# EAGLE design nhd-4_3-adapter (EAGLE 6.4)

## Sheet 1 of 2: TFT Conn
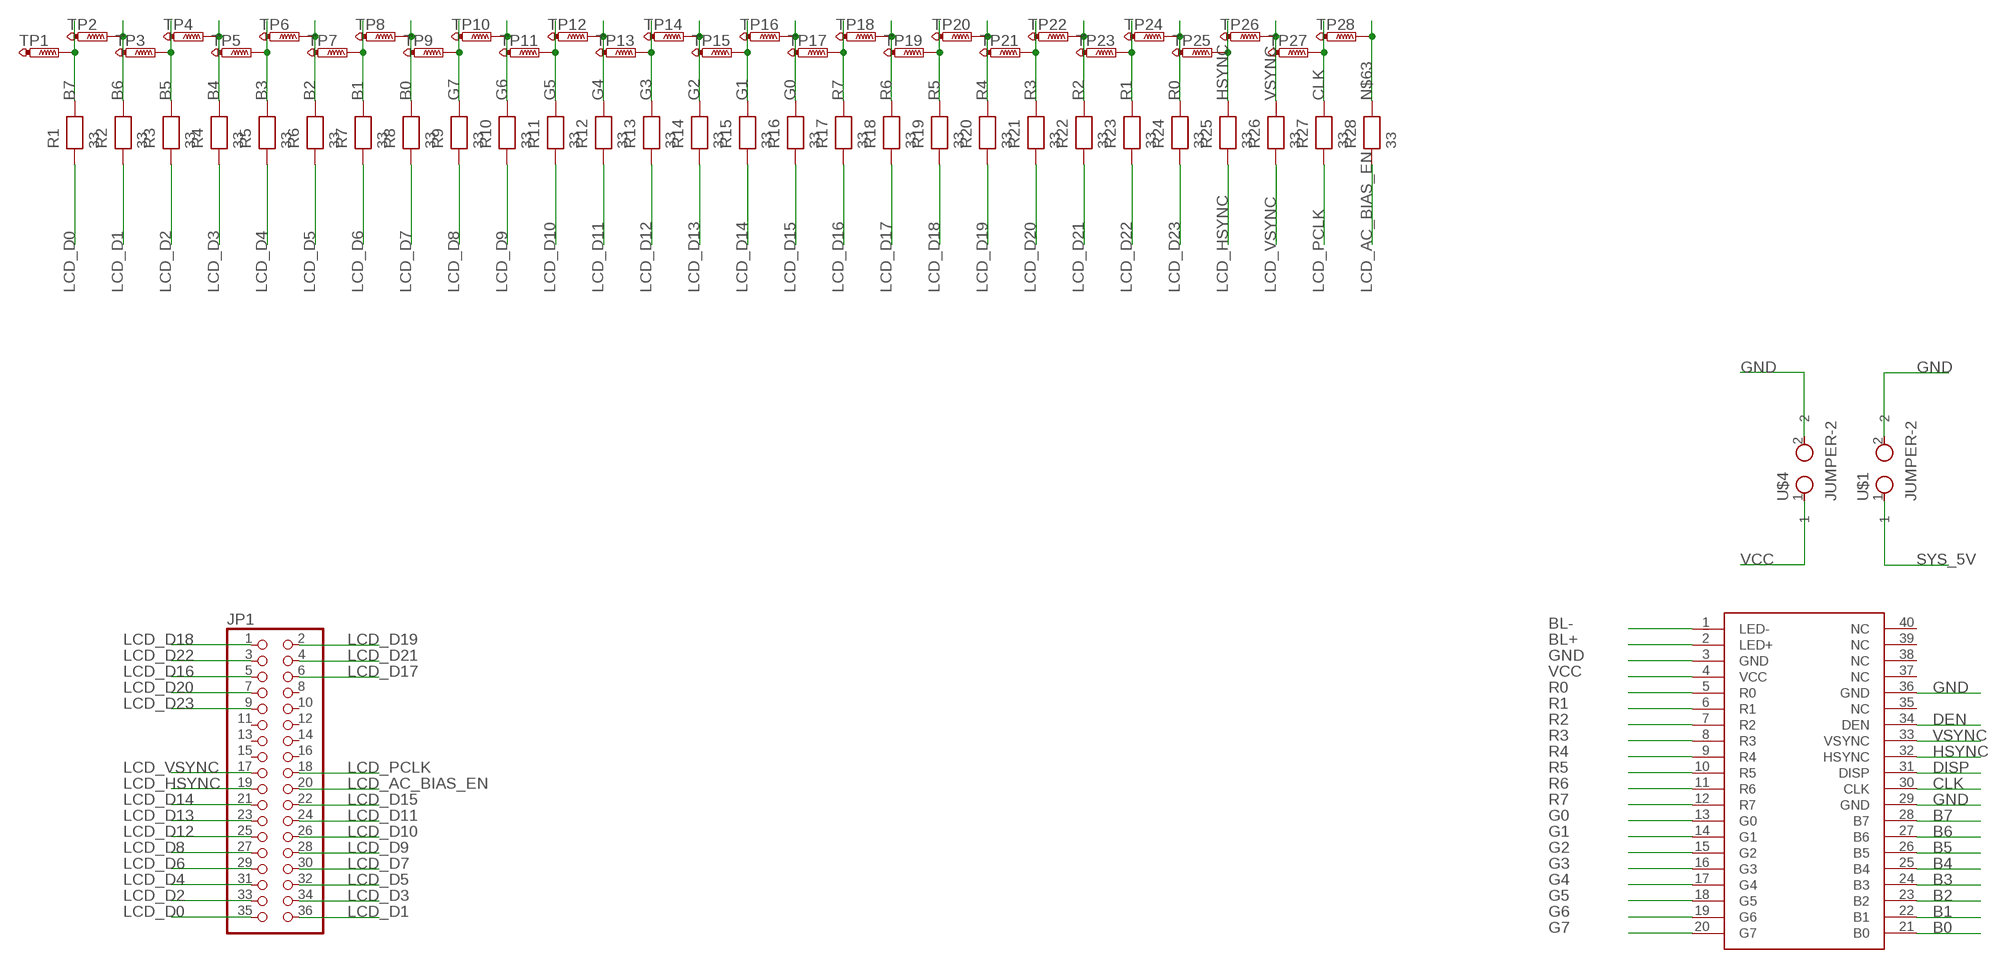
[diagram p0: schematic, sheet 1]

### Parts
JP1  PINHD-2X18_2.54  [2X18]
R1  33  PRES0402LEVEL3  [R0402]
R2  33  PRES0402LEVEL3  [R0402]
R3  33  PRES0402LEVEL3  [R0402]
R4  33  PRES0402LEVEL3  [R0402]
R5  33  PRES0402LEVEL3  [R0402]
R6  33  PRES0402LEVEL3  [R0402]
R7  33  PRES0402LEVEL3  [R0402]
R8  33  PRES0402LEVEL3  [R0402]
R9  33  PRES0402LEVEL3  [R0402]
R10  33  PRES0402LEVEL3  [R0402]
R11  33  PRES0402LEVEL3  [R0402]
R12  33  PRES0402LEVEL3  [R0402]
R13  33  PRES0402LEVEL3  [R0402]
R14  33  PRES0402LEVEL3  [R0402]
R15  33  PRES0402LEVEL3  [R0402]
R16  33  PRES0402LEVEL3  [R0402]
R17  33  PRES0402LEVEL3  [R0402]
R18  33  PRES0402LEVEL3  [R0402]
R19  33  PRES0402LEVEL3  [R0402]
R20  33  PRES0402LEVEL3  [R0402]
R21  33  PRES0402LEVEL3  [R0402]
R22  33  PRES0402LEVEL3  [R0402]
R23  33  PRES0402LEVEL3  [R0402]
R24  33  PRES0402LEVEL3  [R0402]
R25  33  PRES0402LEVEL3  [R0402]
R26  33  PRES0402LEVEL3  [R0402]
R27  33  PRES0402LEVEL3  [R0402]
R28  33  PRES0402LEVEL3  [R0402]
TFT1  NHD-4.3-480272EF-ATXL  [40-PIN_SMD]
TP1  TESTPAD_PTR1TP06R  [TESTPAD_TP06R]
TP2  TESTPAD_PTR1TP06R  [TESTPAD_TP06R]
TP3  TESTPAD_PTR1TP06R  [TESTPAD_TP06R]
TP4  TESTPAD_PTR1TP06R  [TESTPAD_TP06R]
TP5  TESTPAD_PTR1TP06R  [TESTPAD_TP06R]
TP6  TESTPAD_PTR1TP06R  [TESTPAD_TP06R]
TP7  TESTPAD_PTR1TP06R  [TESTPAD_TP06R]
TP8  TESTPAD_PTR1TP06R  [TESTPAD_TP06R]
TP9  TESTPAD_PTR1TP06R  [TESTPAD_TP06R]
TP10  TESTPAD_PTR1TP06R  [TESTPAD_TP06R]
TP11  TESTPAD_PTR1TP06R  [TESTPAD_TP06R]
TP12  TESTPAD_PTR1TP06R  [TESTPAD_TP06R]
TP13  TESTPAD_PTR1TP06R  [TESTPAD_TP06R]
TP14  TESTPAD_PTR1TP06R  [TESTPAD_TP06R]
TP15  TESTPAD_PTR1TP06R  [TESTPAD_TP06R]
TP16  TESTPAD_PTR1TP06R  [TESTPAD_TP06R]
TP17  TESTPAD_PTR1TP06R  [TESTPAD_TP06R]
TP18  TESTPAD_PTR1TP06R  [TESTPAD_TP06R]
TP19  TESTPAD_PTR1TP06R  [TESTPAD_TP06R]
TP20  TESTPAD_PTR1TP06R  [TESTPAD_TP06R]
TP21  TESTPAD_PTR1TP06R  [TESTPAD_TP06R]
TP22  TESTPAD_PTR1TP06R  [TESTPAD_TP06R]
TP23  TESTPAD_PTR1TP06R  [TESTPAD_TP06R]
TP24  TESTPAD_PTR1TP06R  [TESTPAD_TP06R]
TP25  TESTPAD_PTR1TP06R  [TESTPAD_TP06R]
TP26  TESTPAD_PTR1TP06R  [TESTPAD_TP06R]
TP27  TESTPAD_PTR1TP06R  [TESTPAD_TP06R]
TP28  TESTPAD_PTR1TP06R  [TESTPAD_TP06R]
U$1  JUMPER-2  [1X02]
U$4  JUMPER-2  [1X02]

### Nets
B0: R8.P$2 TFT1.21(B0) TP8.TP
B1: R7.P$2 TFT1.22(B1) TP7.TP
B2: R6.P$2 TFT1.23(B2) TP6.TP
B3: R5.P$2 TFT1.24(B3) TP5.TP
B4: R4.P$2 TFT1.25(B4) TP4.TP
B5: R3.P$2 TFT1.26(B5) TP3.TP
B6: R2.P$2 TFT1.27(B6) TP2.TP
B7: R1.P$2 TFT1.28(B7) TP1.TP
BL+: TFT1.2(LED+) ; also sheet 2
BL-: TFT1.1(LED-) ; also sheet 2
CLK: R27.P$2 TFT1.30(CLK) TP27.TP
DEN: TFT1.34(DEN)
DISP: TFT1.31(DISP)
G0: R16.P$2 TFT1.13(G0) TP16.TP
G1: R15.P$2 TFT1.14(G1) TP15.TP
G2: R14.P$2 TFT1.15(G2) TP14.TP
G3: R13.P$2 TFT1.16(G3) TP13.TP
G4: R12.P$2 TFT1.17(G4) TP12.TP
G5: R11.P$2 TFT1.18(G5) TP11.TP
G6: R10.P$2 TFT1.19(G6) TP10.TP
G7: R9.P$2 TFT1.20(G7) TP9.TP
GND: TFT1.3(GND) TFT1.29(GND) TFT1.36(GND) U$1.2 U$4.2 ; also sheet 2
HSYNC: R25.P$2 TFT1.32(HSYNC) TP25.TP
LCD_AC_BIAS_EN: JP1.20 R28.P$1
LCD_D0: JP1.35 R1.P$1
LCD_D1: JP1.36 R2.P$1
LCD_D2: JP1.33 R3.P$1
LCD_D3: JP1.34 R4.P$1
LCD_D4: JP1.31 R5.P$1
LCD_D5: JP1.32 R6.P$1
LCD_D6: JP1.29 R7.P$1
LCD_D7: JP1.30 R8.P$1
LCD_D8: JP1.27 R9.P$1
LCD_D9: JP1.28 R10.P$1
LCD_D10: JP1.26 R11.P$1
LCD_D11: JP1.24 R12.P$1
LCD_D12: JP1.25 R13.P$1
LCD_D13: JP1.23 R14.P$1
LCD_D14: JP1.21 R15.P$1
LCD_D15: JP1.22 R16.P$1
LCD_D16: JP1.5 R17.P$1
LCD_D17: JP1.6 R18.P$1
LCD_D18: JP1.1 R19.P$1
LCD_D19: JP1.2 R20.P$1
LCD_D20: JP1.7 R21.P$1
LCD_D21: JP1.4 R22.P$1
LCD_D22: JP1.3 R23.P$1
LCD_D23: JP1.9 R24.P$1
LCD_HSYNC: JP1.19 R25.P$1
LCD_PCLK: JP1.18 R27.P$1
LCD_VSYNC: JP1.17 R26.P$1
N$63: R28.P$2 TP28.TP
R0: R24.P$2 TFT1.5(R0) TP24.TP
R1: R23.P$2 TFT1.6(R1) TP23.TP
R2: R22.P$2 TFT1.7(R2) TP22.TP
R3: R21.P$2 TFT1.8(R3) TP21.TP
R4: R20.P$2 TFT1.9(R4) TP20.TP
R5: R19.P$2 TFT1.10(R5) TP19.TP
R6: R18.P$2 TFT1.11(R6) TP18.TP
R7: R17.P$2 TFT1.12(R7) TP17.TP
SYS_5V: U$1.1 ; also sheet 2
VCC: TFT1.4(VCC) U$4.1 ; also sheet 2
VSYNC: R26.P$2 TFT1.33(VSYNC) TP26.TP
Unconnected: JP1.8 JP1.10 JP1.11 JP1.12 JP1.13 JP1.14 JP1.15 JP1.16 TFT1.35(NC) TFT1.37(NC) TFT1.38(NC) TFT1.39(NC) TFT1.40(NC)

## Sheet 2 of 2: Backlight
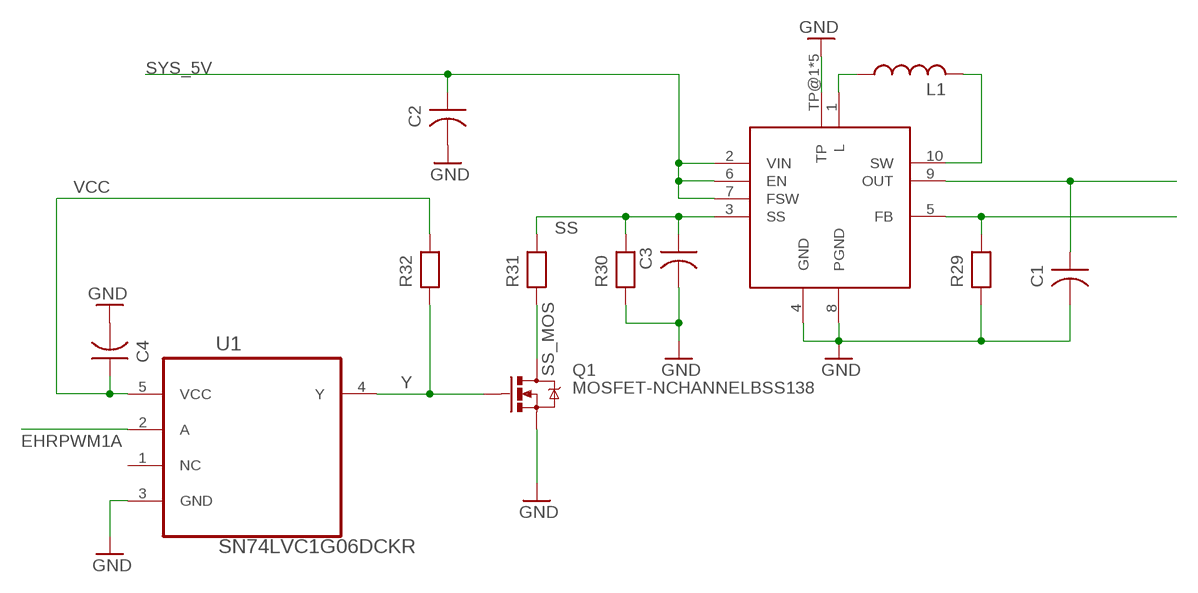
[diagram p1: schematic, sheet 2]

### Parts
C1  PCAP0805LEVEL3  [R0805]
C2  PCAP0805LEVEL3  [R0805]
C3  PCAP0603LEVEL3  [R0603]
C4  PCAP0603LEVEL3  [R0603]
L1  L-US  [VLCF4018-2]
Q1  MOSFET-NCHANNELBSS138  [SOT23]
R29  PRES0603LEVEL3  [R0603]
R30  PRES0603LEVEL3  [R0603]
R31  PRES0603LEVEL3  [R0603]
R32  PRES0603LEVEL3  [R0603]
U1  SN74LVC1G06DCKR  [SOT65P210X110-5N]
U$2  TPS61080  [VSON-10]

### Nets
BL+: C1.P$2 U$2.9(OUT) ; also sheet 1
BL-: R29.P$2 U$2.5(FB) ; also sheet 1
EHRPWM1A: U1.2(A)
GND: C1.P$1 C2.P$1 C3.P$1 C4.P$1 Q1.2(S) R29.P$1 R30.P$1 U1.3(GND) U$2.4(GND) U$2.8(PGND) U$2.TP@1(TP) U$2.TP@2(TP) U$2.TP@3(TP) U$2.TP@4(TP) U$2.TP@5(TP) ; also sheet 1
L: L1.1 U$2.1(L)
SS: C3.P$2 R30.P$2 R31.P$2 U$2.3(SS)
SS_MOS: Q1.3(D) R31.P$1
SW: L1.2 U$2.10(SW)
SYS_5V: C2.P$2 U$2.2(VIN) U$2.6(EN) U$2.7(FSW) ; also sheet 1
VCC: C4.P$2 R32.P$2 U1.5(VCC) ; also sheet 1
Y: Q1.1(G) R32.P$1 U1.4(Y)
Unconnected: U1.1(NC)

## Library data of the parts
C1 C2 = rcl_pro:PCAP0805
C3 C4 = rcl_pro:PCAP0603
JP1 = pinhead-1:PINHD-2X18: PIN HEADER
L1 = rcl:L-US: INDUCTOR, American symbol
Q1 = SparkFun-DiscreteSemi:MOSFET-NCHANNEL: Common NMOSFET Parts MFG P/N Store ID Prod ID FDD8780 TRANS-09984 SI7820DN TRANS-11055 FDS6630A IC-08089 2N7002PW TRANS-11151 FQP30N06L COM-10213 TRANS-10060 BSS123LT1G TRANS-08345 BSS138 TRANS-00830 BS170 2N7000; PROD_ID: TRANS-00830
R1-R28 = rcl_pro:PRES0402
R29-R32 = rcl_pro:PRES0603
TFT1 = molex_connectors_smd:NHD-4.3-480272EF-ATXL
TP1-TP28 = ALFAT_Lib:TESTPAD_PTR1: TEST PIN
U1 = Texas Instruments_By_element14_Batch_1:SN74LVC1G06DCKR: SINGLE INVERTER BUFFER/DRIVER WITH OPEN-DRAIN OUTPUT; MPN: SN74LVC1G06DCKR; OC_FARNELL: 1871697; OC_NEWARK: 76C4074; PACKAGE: SC70-5; SUPPLIER: Texas Instruments
U$1 U$4 = pinhead:JUMPER-2
U$2 = ti_backlight_driver:TPS61080: LED Controller - INPUT: 2.5V - 6V - OUTPUT: Up to 27V - TYPICAL OUTPUT - INPUT: 5V - 12V @ 400mA - 24V @ 170mA - Short Circuit Protection - 1.2-MHz / 600-kHz Selectable Fixed Switching Frequency - In/Out Isolation - Boost Conversion - 3V - 12V - 5V - 12V - 24V

## Board
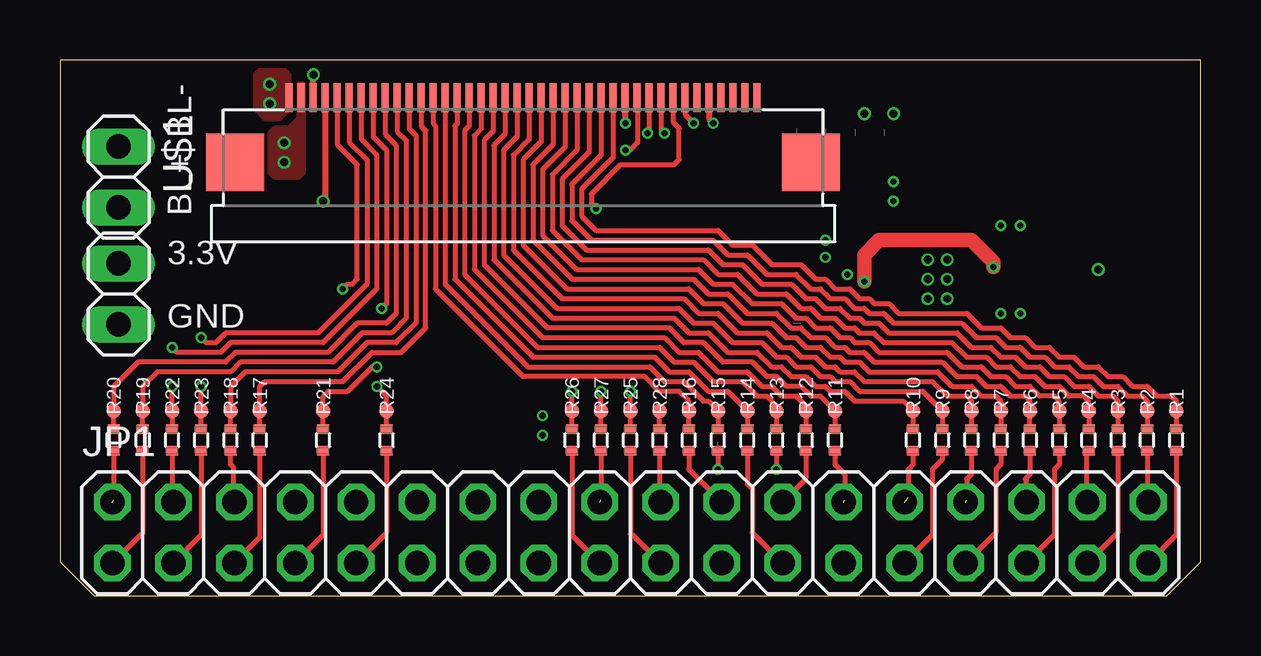
[diagram p2: board, top side]
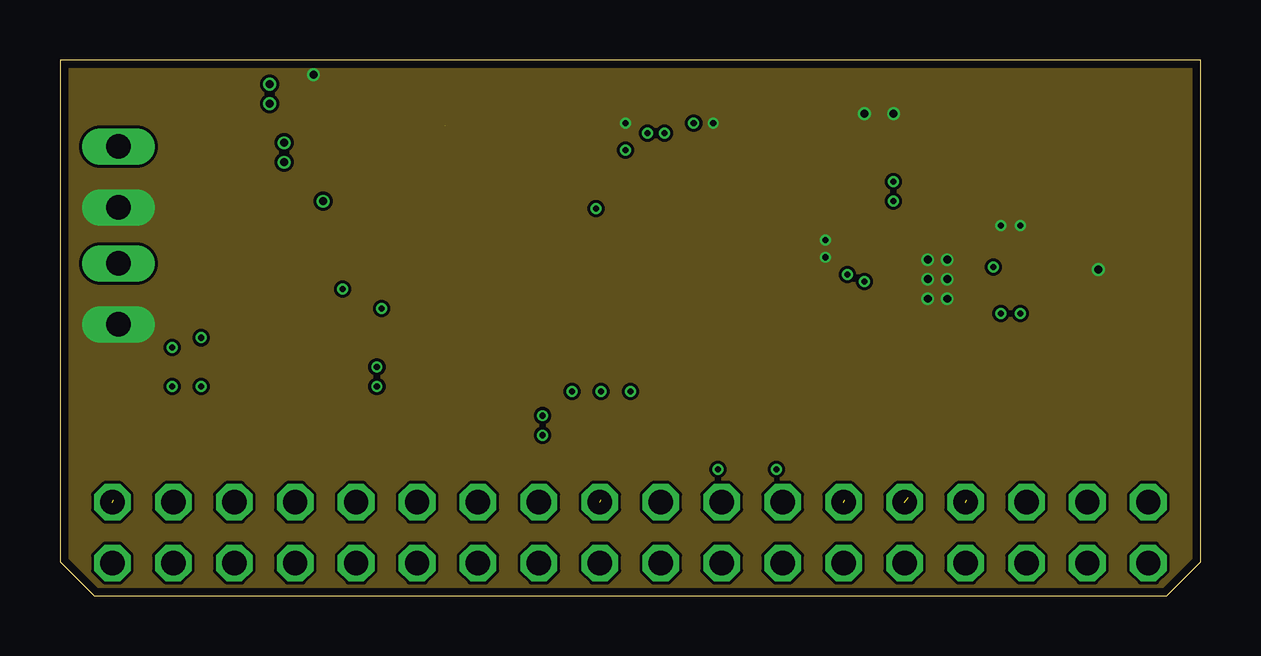
[diagram p3: board, inner layer Route2]
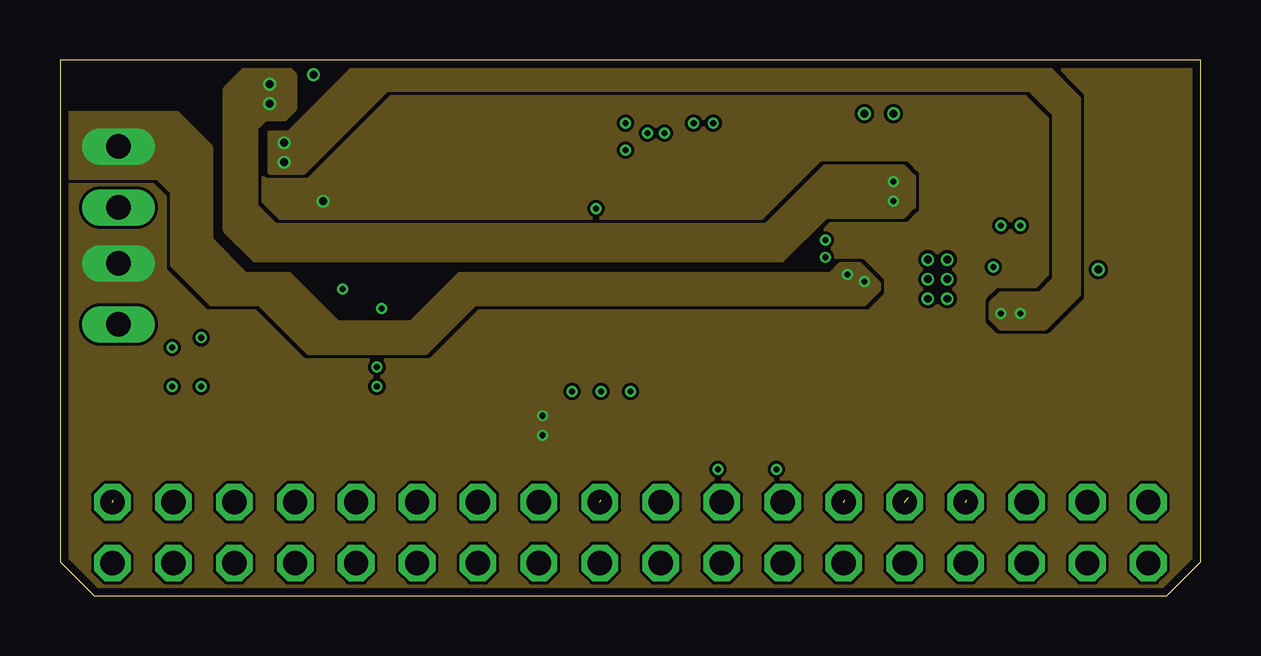
[diagram p4: board, inner layer Route3]
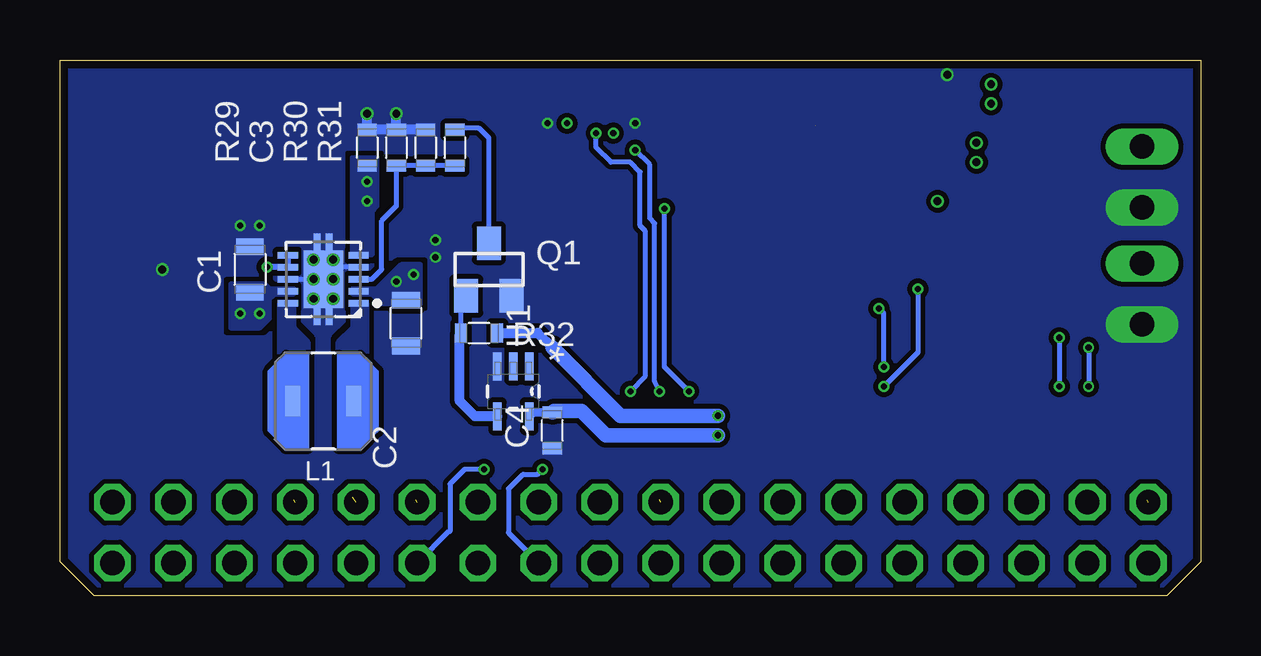
[diagram p5: board, bottom side, seen from below]

Size 47.55 x 22.35 mm. Coordinates in mm from the lower left corner, seen from the top.
Outline: 1.42,0 46.13,0 47.55,1.42 47.55,22.35 0,22.35 0,1.42 1.42,0
Copper layers (1*2*3*16): Top 0.035559375mm / dielectric 0.17018125mm / Route2 0.01778125mm / dielectric 47mil / Route3 0.01778125mm / dielectric 0.17018125mm / Bottom 0.035559375mm
Design rules "default *": minimum track width 5mil, minimum drill 10mil, track to track 5mil, track to pad 5mil, pad to pad 5mil, via to via 5mil, smd to smd 2mil, copper to edge 13mil, drill to drill 8mil, minimum pad ring 4mil, minimum via ring 4mil, stop-mask expansion 4mil, vias tented up to drill 13mil, thermal gap 10mil

### Footprints (pad centres in the part's own frame; a part is rotated, then mirrored left to right if it is on the bottom)
R0805 = smd 0.7 x 1.15: P$1 -0.95,0; P$2 0.95,0
R0603 = smd 0.5 x 0.8: P$1 -0.75,0; P$2 0.75,0
2X18 = drill 1.016 octagon: 1 -21.59,-1.27; 2 -21.59,1.27; 3 -19.05,-1.27; 4 -19.05,1.27; 5 -16.51,-1.27; 6 -16.51,1.27; 7 -13.97,-1.27; 8 -13.97,1.27; 9 -11.43,-1.27; 10 -11.43,1.27; 11 -8.89,-1.27; 12 -8.89,1.27; 13 -6.35,-1.27; 14 -6.35,1.27; 15 -3.81,-1.27; 16 -3.81,1.27; 17 -1.27,-1.27; 18 -1.27,1.27; 19 1.27,-1.27; 20 1.27,1.27; 21 3.81,-1.27; 22 3.81,1.27; 23 6.35,-1.27; 24 6.35,1.27; 25 8.89,-1.27; 26 8.89,1.27; 27 11.43,-1.27; 28 11.43,1.27; 29 13.97,-1.27; 30 13.97,1.27; 31 16.51,-1.27; 32 16.51,1.27; 33 19.05,-1.27; 34 19.05,1.27; 35 21.59,-1.27; 36 21.59,1.27
VLCF4018-2 = smd 1.27 x 0.635: 1 0,1.27; 2 0,-1.27
SOT23 = smd 1 x 1.4: 1 -0.95,-1.1; 2 0.95,-1.1; 3 0,1.1
R0402 = smd 0.4 x 0.5: P$1 -0.45,0; P$2 0.45,0
40-PIN_SMD = smd 0.3 x 1.2: 1 -9.75,0; 2 -9.25,0; 3 -8.75,0; 4 -8.25,0; 5 -7.75,0; 6 -7.25,0; 7 -6.75,0; 8 -6.25,0; 9 -5.75,0; 10 -5.25,0; 11 -4.75,0; 12 -4.25,0; 13 -3.75,0; 14 -3.25,0; 15 -2.75,0; 16 -2.25,0; 17 -1.75,0; 18 -1.25,0; 19 -0.75,0; 20 -0.25,0; 21 0.25,0; 22 0.75,0; 23 1.25,0; 24 1.75,0; 25 2.25,0; 26 2.75,0; 27 3.25,0; 28 3.75,0; 29 4.25,0; 30 4.75,0; 31 5.25,0; 32 5.75,0; 33 6.25,0; 34 6.75,0; 35 7.25,0; 36 7.75,0; 37 8.25,0; 38 8.75,0; 39 9.25,0; 40 9.75,0 | smd 2.4 x 2.4: P$41 -12,-2.7; P$42 12,-2.7
TESTPAD_TP06R = smd 0.6 x 0.6: TP 0,0
SOT65P210X110-5N = smd 1.168 x 0.356: 1 -1.041,0.66; 2 -1.041,0; 3 -1.041,-0.66; 4 1.041,-0.66; 5 1.041,0.66
1X02 = drill 1.016 long: 1 -1.27,0; 2 1.27,0
VSON-10 = smd 0.28 x 0.85: 1 -1,-1.475; 2 -0.5,-1.475; 3 0,-1.475; 4 0.5,-1.475; 5 1,-1.475; 6 1,1.475; 7 0.5,1.475; 8 0,1.475; 9 -0.5,1.475; 10 -1,1.475 | smd 2.4 x 1.65: TP@1 0,0 | smd 0.7 x 0.28: TP@2 -1.55,0.25; TP@3 -1.55,-0.25; TP@4 1.55,-0.25; TP@5 1.55,0.25

### Placement (x,y rotation side)
C1  39.62,13.61 270 bottom
C2  33.12,11.38 90 bottom
C3  33.53,18.69 270 bottom
C4  27.03,6.91 90 bottom
JP1  23.77,2.64 0 top
L1  36.58,8.13 270 bottom
Q1  29.67,13.61 0 bottom
R1  46.53,6.5 90 top
R2  45.31,6.5 90 top
R3  44.09,6.5 90 top
R4  42.88,6.5 90 top
R5  41.66,6.5 90 top
R6  40.44,6.5 90 top
R7  39.22,6.5 90 top
R8  38,6.5 90 top
R9  36.78,6.5 90 top
R10  35.56,6.5 90 top
R11  32.31,6.5 90 top
R12  31.09,6.5 90 top
R13  29.87,6.5 90 top
R14  28.65,6.5 90 top
R15  27.43,6.5 90 top
R16  26.21,6.5 90 top
R17  8.33,6.5 90 top
R18  7.11,6.5 90 top
R19  3.45,6.5 90 top
R20  2.24,6.5 90 top
R21  10.97,6.5 90 top
R22  4.67,6.5 90 top
R23  5.89,6.5 90 top
R24  13.61,6.5 90 top
R25  23.77,6.5 90 top
R26  21.34,6.5 90 top
R27  22.56,6.5 90 top
R28  24.99,6.5 90 top
R29  34.75,18.69 270 bottom
R30  32.31,18.69 270 bottom
R31  31.09,18.69 270 bottom
R32  30.07,10.97 0 bottom
TFT1  19.3,20.78 0 top
TP1  46.53,7.72 0 top
TP2  45.31,7.72 0 top
TP3  44.09,7.72 0 top
TP4  42.88,7.72 0 top
TP5  41.66,7.72 0 top
TP6  40.44,7.72 0 top
TP7  39.22,7.72 0 top
TP8  38,7.72 0 top
TP9  36.78,7.72 0 top
TP10  35.56,7.72 0 top
TP11  32.31,7.72 0 top
TP12  31.09,7.72 0 top
TP13  29.87,7.72 0 top
TP14  28.65,7.72 0 top
TP15  27.43,7.72 0 top
TP16  26.21,7.72 0 top
TP17  8.33,7.72 0 top
TP18  7.11,7.72 0 top
TP19  3.45,7.72 0 top
TP20  2.24,7.72 0 top
TP21  10.97,7.72 0 top
TP22  4.67,7.72 0 top
TP23  5.89,7.72 0 top
TP24  13.61,7.72 0 top
TP25  23.77,7.72 0 top
TP26  21.34,7.72 0 top
TP27  22.56,7.72 0 top
TP28  24.99,7.72 0 top
U1  28.65,8.53 270 bottom
U$1  2.44,17.48 270 top
U$2  36.58,13.21 90 bottom
U$4  2.44,12.6 270 top

### Tracks (layer width: path | path; a pad name or v marks a point on that pad's centre or on a via)
B0
  Top 0.203: TFT1.21 19.55,19.05 18.9,18.39 18.9,14.43 20.93,12.4 26.01,12.4 26.62,11.79 27.43,11.79 28.24,10.97 29.46,10.97 30.07,10.36 30.48,10.36 30.89,9.96 31.5,9.96 31.9,9.55 32.31,9.55 32.51,9.35 33.12,9.35 33.53,8.94 36.37,8.94 36.98,8.33 37.79,8.33 38,8.13 TP8.TP R8.P$2
B1
  Top 0.203: TFT1.22 20.05,18.94 19.3,18.19 19.3,14.63 21.13,12.8 26.21,12.8 26.82,12.19 27.63,12.19 28.45,11.38 29.67,11.38 30.28,10.77 30.68,10.77 31.09,10.36 31.7,10.36 32.11,9.96 32.51,9.96 32.71,9.75 33.32,9.75 33.73,9.35 36.58,9.35 37.19,8.74 38,8.74 38.4,8.33 39.01,8.33 39.22,8.13 TP7.TP R7.P$2
B2
  Top 0.203: TFT1.23 20.55,18.83 19.71,17.98 19.71,14.83 21.34,13.21 26.42,13.21 27.03,12.6 27.84,12.6 28.65,11.79 29.87,11.79 30.48,11.18 30.89,11.18 31.29,10.77 31.9,10.77 32.31,10.36 32.71,10.36 32.92,10.16 33.53,10.16 33.93,9.75 36.78,9.75 37.39,9.14 38.2,9.14 38.61,8.74 39.22,8.74 39.62,8.33 40.23,8.33 40.44,8.13 TP6.TP R6.P$2
B3
  Top 0.203: TFT1.24 21.05,18.72 20.12,17.78 20.12,15.04 21.54,13.61 26.62,13.61 27.23,13.01 28.04,13.01 28.85,12.19 30.07,12.19 30.68,11.58 31.09,11.58 31.5,11.18 32.11,11.18 32.51,10.77 32.92,10.77 33.12,10.57 33.73,10.57 34.14,10.16 36.98,10.16 37.59,9.55 38.4,9.55 38.81,9.14 39.42,9.14 39.83,8.74 40.44,8.74 40.84,8.33 41.45,8.33 41.66,8.13 TP5.TP R5.P$2
B4
  Top 0.203: TFT1.25 21.55,18.61 20.52,17.58 20.52,15.24 21.74,14.02 26.82,14.02 27.43,13.41 28.24,13.41 29.06,12.6 30.28,12.6 30.89,11.99 31.29,11.99 31.7,11.58 32.31,11.58 32.71,11.18 33.12,11.18 33.32,10.97 33.93,10.97 34.34,10.57 37.19,10.57 37.79,9.96 38.61,9.96 39.01,9.55 39.62,9.55 40.03,9.14 40.64,9.14 41.05,8.74 41.66,8.74 42.06,8.33 42.67,8.33 42.87,8.13 TP4.TP R4.P$2
B5
  Top 0.203: TFT1.26 22.05,18.5 20.93,17.37 20.93,15.44 21.95,14.43 27.03,14.43 27.63,13.82 28.45,13.82 29.26,13.01 30.48,13.01 31.09,12.4 31.5,12.4 31.9,11.99 32.51,11.99 32.92,11.58 33.32,11.58 33.53,11.38 34.14,11.38 34.54,10.97 37.39,10.97 38,10.36 38.81,10.36 39.22,9.96 39.83,9.96 40.23,9.55 40.84,9.55 41.25,9.14 41.86,9.14 42.27,8.74 42.87,8.74 43.28,8.33 43.89,8.33 44.09,8.13 TP3.TP R3.P$2
B6
  Top 0.203: TFT1.27 22.55,18.39 21.34,17.17 21.34,15.65 22.15,14.83 27.23,14.83 27.84,14.22 28.65,14.22 29.46,13.41 30.68,13.41 31.29,12.8 31.7,12.8 32.11,12.4 32.71,12.4 33.12,11.99 33.53,11.99 33.73,11.79 34.34,11.79 34.75,11.38 37.59,11.38 38.2,10.77 39.01,10.77 39.42,10.36 40.03,10.36 40.44,9.96 41.05,9.96 41.45,9.55 42.06,9.55 42.47,9.14 43.08,9.14 43.48,8.74 44.09,8.74 44.5,8.33 45.11,8.33 45.31,8.13 TP2.TP R2.P$2
B7
  Top 0.203: TFT1.28 23.05,18.28 21.74,16.97 21.74,15.85 22.35,15.24 27.43,15.24 28.04,14.63 28.85,14.63 29.67,13.82 30.89,13.82 31.5,13.21 31.9,13.21 32.31,12.8 32.92,12.8 33.32,12.4 33.73,12.4 33.93,12.19 34.54,12.19 34.95,11.79 37.79,11.79 38.4,11.18 39.22,11.18 39.62,10.77 40.23,10.77 40.64,10.36 41.25,10.36 41.66,9.96 42.27,9.96 42.67,9.55 43.28,9.55 43.69,9.14 44.3,9.14 44.7,8.74 45.31,8.74 45.72,8.33 46.33,8.33 46.53,8.13 TP1.TP R1.P$2
BL+  (via drill 0.25, 0.33)
  other vias: 9.35,18.9 9.35,18.08 39.22,11.79 40.03,11.79
  pour Top (rank 2, no thermals): 9.96,21.34 9.96,19.91 9.55,19.51 8.94,19.51 8.74,19.3 8.74,17.68 8.94,17.48 9.96,17.48 10.16,17.68 10.16,21.34
  pour Bottom (no thermals): 37.8,12.8 38.81,12.8 39.01,13 40.44,13 40.44,11.18 39.22,11.18 38.81,11.58 38.81,12.4 38.61,12.6 37.8,12.6
  pour Route3: 38.81,12.19 38.81,11.58 39.22,11.18 41.05,11.18 42.47,12.6 42.47,20.73 41.05,22.15 12.4,22.15 9.55,19.3 8.74,19.3 8.74,17.68 10.16,17.68 13.61,21.13 40.44,21.13 41.45,20.12 41.45,13.21 40.84,12.6 39.22,12.6
BL-  (via drill 0.25, 0.33)
  other vias: 8.74,21.34 8.74,20.52 34.75,17.27 34.75,16.46
  pour Top (no thermals): 9.55,20.32 9.55,21.74 9.14,22.15 8.53,22.15 8.13,21.74 8.13,20.32 8.53,19.91 9.14,19.91
  pour Bottom (no thermals): 34.34,18.29 34.34,16.26 34.54,16.05 34.54,14.22 35.36,14.22 35.36,18.08 35.36,18.29
  pour Route3: 34.54,15.85 31.9,15.85 30.07,14.02 8.13,14.02 6.91,15.24 6.91,21.13 7.92,22.15 9.35,22.15 9.75,21.74 9.75,20.32 9.35,19.91 8.53,19.91 8.13,19.51 8.13,16.26 8.94,15.44 29.46,15.44 30.68,16.66 31.9,17.88 35.15,17.88 35.56,17.48 35.56,16.26 35.15,15.85
CLK  (via drill 0.25)
  Top 0.203: TFT1.30 24.08,20.75 24.08,18.9 23.77,18.59 v23.57,18.59 | R27.P$2 TP27.TP v22.55,8.53
  Bottom 0.203: v22.55,8.53 22.76,8.94 22.76,15.55 22.96,15.75 22.96,17.98 v23.57,18.59
DEN  (via drill 0.25)
  Top 0.203: TFT1.34 26.05,20.07 v26.42,19.71
DISP  (via drill 0.25)
  Top 0.203: TFT1.31 24.55,19.37 v24.49,19.3
G0
  Top 0.203: TFT1.13 15.55,19.7 15.65,19.61 15.65,12.8 19.3,9.14 24.38,9.14 24.99,8.53 25.81,8.53 26.21,8.13 TP16.TP R16.P$2 26.21,6.91
G1  (1 unrouted)
  Top 0.203: TFT1.14 16.05,19.61 | 16.05,19.61 16.05,13.01 19.51,9.55 24.59,9.55 25.2,8.94 26.01,8.94 26.82,8.13 27.03,8.13 TP15.TP R15.P$2
G2
  Top 0.203: TFT1.15 16.55,19.7 16.46,19.61 16.46,13.21 19.71,9.96 24.79,9.96 25.4,9.35 26.21,9.35 27.03,8.53 27.84,8.53 TP14.TP R14.P$2
G3
  Top 0.203: TFT1.16 17.05,19.59 16.87,19.41 16.87,13.41 19.91,10.36 24.99,10.36 25.6,9.75 26.42,9.75 27.23,8.94 28.45,8.94 29.06,8.33 29.46,8.33 29.67,8.13 29.67,7.93 TP13.TP R13.P$2
G4
  Top 0.203: TFT1.17 17.55,19.48 17.27,19.2 17.27,13.61 20.12,10.77 25.2,10.77 25.81,10.16 26.62,10.16 27.43,9.35 28.65,9.35 29.26,8.74 29.67,8.74 30.07,8.33 30.68,8.33 31.09,7.93 TP12.TP R12.P$2
G5
  Top 0.203: TFT1.18 18.05,19.38 17.68,19 17.68,13.82 20.32,11.18 25.4,11.18 26.01,10.57 26.82,10.57 27.63,9.75 28.85,9.75 29.46,9.14 29.87,9.14 30.28,8.74 30.89,8.74 31.29,8.33 31.7,8.33 TP11.TP | TP11.TP R11.P$2 | TP11.TP 32.11,7.72
G6
  Top 0.203: TFT1.19 18.55,19.27 18.08,18.8 18.08,14.02 20.52,11.58 25.6,11.58 26.21,10.97 27.03,10.97 27.84,10.16 29.06,10.16 29.67,9.55 30.07,9.55 30.48,9.14 31.09,9.14 31.5,8.74 31.9,8.74 32.11,8.53 32.71,8.53 33.12,8.13 35.15,8.13 TP10.TP R10.P$2
G7
  Top 0.203: TFT1.20 19.05,19.16 18.49,18.59 18.49,14.22 20.73,11.99 25.81,11.99 26.42,11.38 27.23,11.38 28.04,10.57 29.26,10.57 29.87,9.96 30.28,9.96 30.68,9.55 31.29,9.55 31.7,9.14 32.11,9.14 32.31,8.94 32.92,8.94 33.32,8.53 35.97,8.53 TP9.TP R9.P$2
GND  (via drill 0.25, 0.33)
  Top 0.254: TFT1.3 10.55,21.73 v10.57,21.74 | TFT1.36 27.05,19.89 v27.23,19.71 | TFT1.29 23.55,19.73 v23.57,19.71
  Bottom 0.203: U$2.4 35.86,13.71 v36.17,14.02 | U$2.8 v36.98,13.21
  Bottom 0.406: R30.P$1 C3.P$1 | C3.P$1 R29.P$1 v34.75,20.12 | C3.P$1 v33.53,20.12
  other vias: 36.98,14.02 36.17,13.21 36.17,12.4 36.98,12.4 43.28,13.61 31.9,14.83 39.22,15.44 40.03,15.44 31.9,14.12
  pour Bottom (no thermals): 37.39,11.79 35.76,11.79 35.76,14.43 36.17,14.43 36.17,14.63 36.37,14.83 36.98,14.83 37.39,14.43
  pour Route2 (no thermals): 0.2,22.15 47.35,22.15 47.35,1.63 45.92,0.2 1.63,0.2 0.2,1.63
  pour Bottom (isolate 0.203, rank 6, no thermals): 0.2,22.15 47.35,22.15 47.35,1.63 45.92,0.2 1.63,0.2 0.2,1.63
HSYNC  (via drill 0.25)
  Top 0.203: TFT1.32 25.05,19.45 v25.2,19.3 | R25.P$2 TP25.TP v23.77,8.53
  Bottom 0.203: v23.77,8.53 23.16,9.14 23.16,15.24 23.37,15.44 23.37,17.68 23.77,18.09 24.59,18.09 25.2,18.69 v25.2,19.3
L
  pour Bottom (no thermals): 35.36,12.19 35.36,11.18 35.97,10.57 35.97,6.3 34.95,6.3 34.34,6.91 34.34,9.55 34.75,9.96 34.75,12.19
LCD_AC_BIAS_EN
  Top 0.203: R28.P$1 24.99,3.96 JP1.20
LCD_D0
  Top 0.203: R1.P$1 46.53,2.54 JP1.35
LCD_D1
  Top 0.203: R2.P$1 45.31,3.96 JP1.36
LCD_D2
  Top 0.203: R3.P$1 44.09,2.64 JP1.33
LCD_D3
  Top 0.203: R4.P$1 42.77,5.95 42.77,3.96 JP1.34
LCD_D4
  Top 0.203: R5.P$1 41.66,5.49 41.45,5.28 41.45,2.54 JP1.31
LCD_D5
  Top 0.203: R6.P$1 40.44,5.08 40.23,4.88 40.28,4.83 JP1.32
LCD_D6
  Top 0.203: R7.P$1 39.22,5.49 39.01,5.28 39.01,2.64 JP1.29
LCD_D7  (1 unrouted)
  Top 0.203: R8.P$1 38,5.08 37.79,4.88 37.79,4.01
LCD_D8
  Top 0.203: R9.P$1 36.78,5.69 36.37,5.28 36.37,2.54 JP1.27
LCD_D9  (1 unrouted)
  Top 0.203: R10.P$1 35.56,5.49 35.36,5.28 35.36,4.12
LCD_D10  (1 unrouted)
  Top 0.203: R11.P$1 32.31,5.49 32.71,5.08 32.71,4.01
LCD_D11
  Top 0.203: R12.P$1 31.09,4.88 JP1.24
LCD_D12  (via drill 0.25)
  Top 0.203: R13.P$1 v29.87,5.28
  Bottom 0.203: v29.87,5.28 30.68,5.28 31.29,4.67 31.29,2.69 31.34,2.69 JP1.25
LCD_D13
  Top 0.203: R14.P$1 28.65,4.67 28.85,4.47 28.85,2.64 JP1.23
LCD_D14  (via drill 0.25)
  Top 0.203: R15.P$1 v27.43,5.28
  Bottom 0.203: v27.43,5.28 27.63,5.08 28.24,5.08 28.85,4.47 28.85,2.64 JP1.21
LCD_D15
  Top 0.203: R16.P$1 26.21,5.28 JP1.22
LCD_D16
  Top 0.203: R17.P$1 8.33,2.44 JP1.5
LCD_D17
  Top 0.203: R18.P$1 7.11,5.49 7.21,5.39 7.21,3.96 JP1.6
LCD_D18
  Top 0.203: R19.P$1 3.45,2.64 JP1.1
LCD_D19  (1 unrouted)
  Top 0.203: R20.P$1 2.23,4.01
LCD_D20
  Top 0.203: R21.P$1 10.97,2.54 JP1.7
LCD_D21
  Top 0.203: R22.P$1 4.67,3.96 JP1.4
LCD_D22
  Top 0.203: R23.P$1 5.89,2.54 JP1.3
LCD_D23
  Top 0.203: R24.P$1 13.61,2.64 JP1.9
LCD_HSYNC
  Top 0.203: R25.P$1 23.77,2.59 23.82,2.59 JP1.19
LCD_PCLK  (1 unrouted)
  Top 0.203: R27.P$1 22.55,4.01
LCD_VSYNC
  Top 0.203: R26.P$1 21.34,2.49 21.39,2.49 JP1.17
N$63
  Top 0.203: R28.P$2 TP28.TP
R0  (via drill 0.25)
  Top 0.203: TFT1.5 11.55,18.82 12.39,17.98 12.39,13.21 12.19,13.01 11.99,13.01 v11.79,12.8 | R24.P$2 TP24.TP 13.61,8.33 v13.21,8.74
  Bottom 0.203: v11.79,12.8 11.79,10.16 v13.21,8.74
R1  (via drill 0.25)
  Top 0.203: TFT1.6 12.05,18.93 12.8,18.19 12.8,13.01 10.77,10.97 6.91,10.97 6.5,10.57 6.1,10.57 v5.89,10.77 | R23.P$2 TP23.TP v5.89,8.74
  Bottom 0.203: v5.89,10.77 v5.89,8.74
R2  (via drill 0.25)
  Top 0.203: TFT1.7 12.55,19.04 13.21,18.39 13.21,12.8 10.97,10.57 7.11,10.57 6.71,10.16 4.88,10.16 v4.67,10.36 | v4.67,8.74 TP22.TP R22.P$2
  Bottom 0.203: v4.67,10.36 v4.67,8.74
R3  (via drill 0.25)
  Top 0.203: TFT1.8 13.05,19.15 13.61,18.59 13.61,12.19 v13.41,11.99 | R21.P$2 TP21.TP 10.97,8.33 11.18,8.53 11.99,8.53 13,9.55 v13.21,9.55
  Bottom 0.203: v13.21,9.55 13.21,11.79 v13.41,11.99
R4
  Top 0.203: TFT1.9 13.55,19.26 14.02,18.8 14.02,11.79 13.61,11.38 12.39,11.38 11.18,10.16 7.31,10.16 6.91,9.75 3.25,9.75 2.23,8.74 TP20.TP R20.P$2
R5
  Top 0.203: TFT1.10 14.05,19.37 14.43,19 14.43,11.58 13.82,10.97 12.6,10.97 11.38,9.75 7.52,9.75 7.11,9.35 4.06,9.35 3.45,8.74 TP19.TP R19.P$2
R6
  Top 0.203: TFT1.11 14.55,19.48 14.83,19.2 14.83,11.38 14.02,10.57 12.8,10.57 11.58,9.35 7.72,9.35 7.11,8.74 TP18.TP R18.P$2
R7
  Top 0.203: TFT1.12 15.05,19.59 15.24,19.41 15.24,11.18 14.22,10.16 13,10.16 11.79,8.94 8.53,8.94 8.33,8.74 TP17.TP R17.P$2
SS
  Bottom 0.203: R31.P$2 R30.P$2 C3.P$2 33.53,16.26 34.14,15.65 34.14,13.61 34.54,13.21 U$2.3
SS_MOS
  Bottom 0.203: Q1.3 29.67,19.1 30.07,19.51 31.03,19.51 R31.P$1
SW
  pour Bottom (no thermals): 37.19,6.3 37.19,10.57 37.8,11.18 37.8,12.19 38.4,12.19 38.4,9.96 38.81,9.55 38.81,6.91 38.2,6.3
SYS_5V  (via drill 0.25)
  Top 0.61: v38.91,13.72 38.91,13.92 38,14.83 34.14,14.83 33.53,14.22 v33.53,13.11
  Bottom 0.254: U$2.6 U$2.7 v38.9,13.71 v38.91,13.72
  other vias: 32.82,13.41
  pour Bottom (rank 2, no thermals): 35.36,12.6 34.54,12.6 34.14,12.19 32.51,12.19 32.51,13.82 33.32,13.82 34.34,12.8 35.36,12.8
  pour Route3 (no thermals): 33.32,13.82 32.51,13.82 32.11,13.41 16.66,13.41 14.63,11.38 11.58,11.38 9.55,13.41 7.72,13.41 6.3,14.83 6.3,18.69 4.88,20.12 0.2,20.12 0.2,17.48 4.06,17.48 4.67,16.87 4.67,13.82 6.3,12.19 8.33,12.19 10.36,10.16 15.24,10.16 17.27,12.19 33.53,12.19 34.14,12.8 34.14,13
VCC  (via drill 0.25, 0.33)
  Top 0.254: TFT1.4 11.05,16.54 v10.97,16.46
  Bottom 0.356: C4.P$2 27.82,7.66 U1.5
  Bottom 0.406: R32.P$2 27.63,10.97 27.03,10.36
  Bottom 0.61: v20.12,6.71 24.79,6.71 25.81,7.72 26.96,7.72 C4.P$2 | 27.03,10.36 24.18,7.52 v20.12,7.52
  pour Route3 (rank 6, no thermals): 0.2,22.15 47.35,22.15 47.35,1.63 45.92,0.2 1.63,0.2 0.2,1.63
VSYNC  (via drill 0.25)
  Top 0.203: v22.35,16.15 22.15,16.36 22.15,16.76 23.37,17.98 25.6,17.98 25.81,18.19 25.81,19.51 25.55,19.76 TFT1.33 | R26.P$2 TP26.TP v21.34,8.53
  Bottom 0.203: v21.34,8.53 22.35,9.55 v22.35,16.15
Y
  Bottom 0.203: R32.P$1 30.82,12.31 Q1.1
  Bottom 0.406: U1.4 30.25,7.49 30.89,8.13 30.89,10.91 R32.P$1

### Text on the board
tPlace: BL- | BL+ | 3.3V | GND